# EAGLE schematic oven (EAGLE 9.4.2)
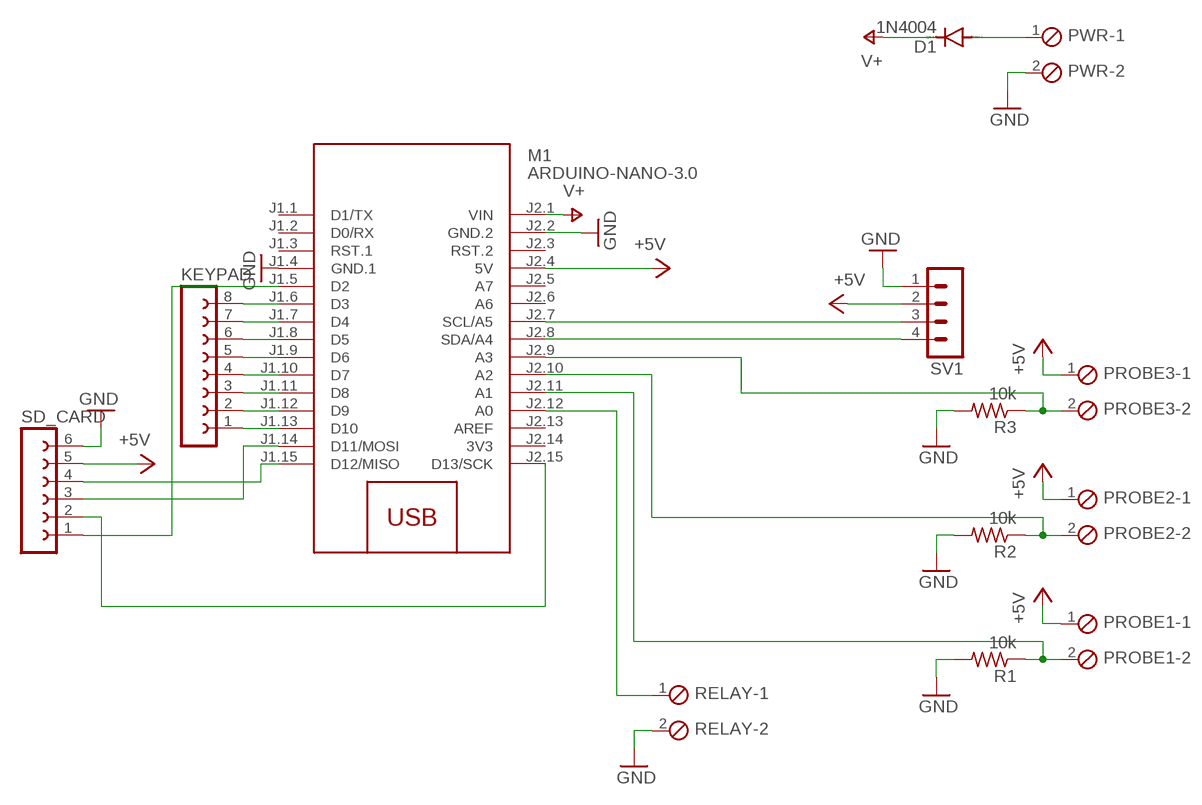
[diagram p0: schematic, sheet 1]

## Parts
D1  1N4004  [DO41-10]
KEYPAD  FE08-1  [FE08]
M1  ARDUINO-NANO-3.0  [ARDUINO-NANO-3.0]
PROBE1  MPT2  [2POL254]
PROBE2  MPT2  [2POL254]
PROBE3  MPT2  [2POL254]
PWR  MPT2  [2POL254]
R1  10k  R-US_0204/5  [0204/5]
R2  10k  R-US_0204/5  [0204/5]
R3  10k  R-US_0204/5  [0204/5]
RELAY  MPT2  [2POL254]
SD_CARD  FE06W  [FE06W]
SV1  MA04-1  [MA04-1]

## Nets
+5V: M1.J2.4(5V) PROBE1.1 PROBE2.1 PROBE3.1 SD_CARD.5 SV1.2
GND: M1.J1.4(GND.1) M1.J2.2(GND.2) PWR.2 R1.2 R2.2 R3.2 RELAY.2 SD_CARD.6 SV1.1
N$1: KEYPAD.1 M1.J1.13(D10)
N$2: KEYPAD.2 M1.J1.12(D9)
N$3: KEYPAD.3 M1.J1.11(D8)
N$4: KEYPAD.4 M1.J1.10(D7)
N$5: KEYPAD.5 M1.J1.9(D6)
N$6: KEYPAD.6 M1.J1.8(D5)
N$7: KEYPAD.7 M1.J1.7(D4)
N$8: KEYPAD.8 M1.J1.6(D3)
N$9: M1.J2.7(SCL/A5) SV1.3
N$10: M1.J2.8(SDA/A4) SV1.4
N$11: M1.J2.11(A1) PROBE1.2 R1.1
N$12: D1.A PWR.1
N$13: M1.J2.9(A3) PROBE3.2 R3.1
N$14: M1.J2.10(A2) PROBE2.2 R2.1
N$15: M1.J1.5(D2) SD_CARD.1
N$16: M1.J2.15(D13/SCK) SD_CARD.2
N$17: M1.J1.15(D12/MISO) SD_CARD.4
N$18: M1.J1.14(D11/MOSI) SD_CARD.3
N$20: M1.J2.12(A0) RELAY.1
V+: D1.C M1.J2.1(VIN)
Unconnected: M1.J1.1(D1/TX) M1.J1.2(D0/RX) M1.J1.3(RST.1) M1.J2.3(RST.2) M1.J2.5(A7) M1.J2.6(A6) M1.J2.13(AREF)

## Power pins joined to a net without a drawn wire
3V3: M1.J2.14(3V3)

## Library data of the parts
D1 = diode:1N4004: DIODE general purpose rectifier, 1 A
KEYPAD = con-lsta:FE08-1: FEMALE HEADER; OC_FARNELL: unknown; OC_NEWARK: unknown
M1 = diy-modules:ARDUINO-NANO-3.0: Arduino Nano 3.0 and compatible devices More details available here: https://www.arduino.cc/en/Main/ArduinoBoardNano Click here to find device on ebay.com <http://www.ebay.com/sch/arduino+nano>
PROBE1-PROBE3 PWR RELAY = con-phoenix-254:MPT2: PHOENIX CONNECTOR; OC_FARNELL: unknown; OC_NEWARK: unknown
R1-R3 = rcl:R-US_: RESISTOR, American symbol; SPICEPREFIX: R
SD_CARD = con-lsta:FE06W: FEMALE HEADER; OC_FARNELL: unknown; OC_NEWARK: unknown
SV1 = con-lstb:MA04-1: PIN HEADER; OC_FARNELL: unknown; OC_NEWARK: unknown